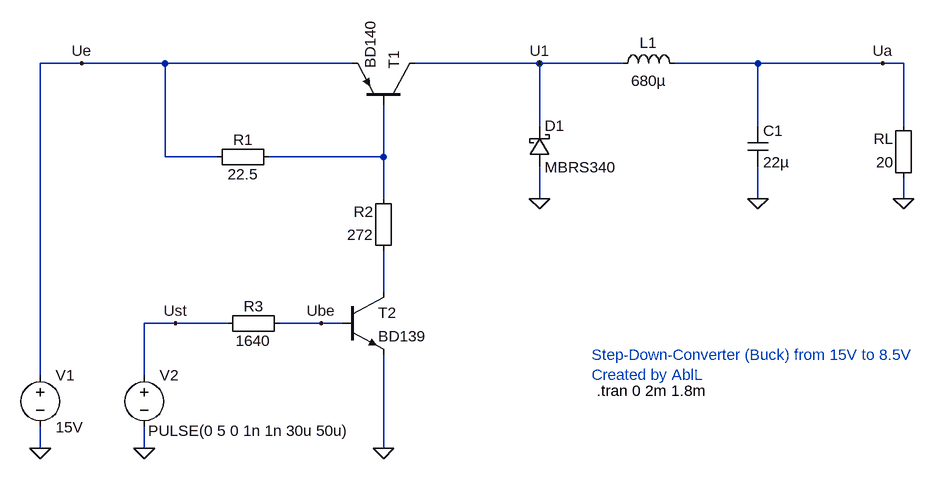
[diagram p0: schematic Step-Down-Converter.asc]
Step-Down-Converter.asc, the LTspice schematic file:
Version 4
SHEET 1 2692 704
WIRE 208 -160 144 -160
WIRE 336 -160 208 -160
WIRE 624 -160 336 -160
WIRE 912 -160 720 -160
WIRE 1040 -160 912 -160
WIRE 1248 -160 1120 -160
WIRE 1440 -160 1248 -160
WIRE 1472 -160 1440 -160
WIRE 912 -64 912 -160
WIRE 1248 -64 1248 -160
WIRE 1472 -64 1472 -160
WIRE 336 -16 336 -160
WIRE 416 -16 336 -16
WIRE 672 -16 672 -96
WIRE 672 -16 496 -16
WIRE 672 48 672 -16
WIRE 912 48 912 0
WIRE 1248 48 1248 0
WIRE 1472 48 1472 16
WIRE 672 192 672 128
WIRE 352 240 304 240
WIRE 432 240 352 240
WIRE 576 240 512 240
WIRE 608 240 576 240
WIRE 144 320 144 -160
WIRE 304 320 304 240
WIRE 144 432 144 400
WIRE 304 432 304 400
WIRE 672 432 672 288
FLAG 144 432 0
FLAG 304 432 0
FLAG 672 432 0
FLAG 912 48 0
FLAG 1248 48 0
FLAG 1472 48 0
FLAG 1440 -160 Ua
FLAG 208 -160 Ue
FLAG 352 240 Ust
FLAG 576 240 Ube
FLAG 912 -160 U1
SYMBOL voltage 144 304 R0
WINDOW 123 0 0 Left 0
WINDOW 39 0 0 Left 0
SYMATTR InstName V1
SYMATTR Value 15V
SYMBOL voltage 304 304 R0
WINDOW 3 6 101 Left 2
WINDOW 123 0 0 Left 0
WINDOW 39 0 0 Left 0
SYMATTR Value PULSE(0 5 0 1n 1n 30u 50u)
SYMATTR InstName V2
SYMBOL Misc\\EuropeanResistor 512 -32 R90
WINDOW 0 5 56 VBottom 2
WINDOW 3 27 56 VTop 2
SYMATTR InstName R1
SYMATTR Value 22.5
SYMBOL Misc\\EuropeanResistor 688 144 R180
WINDOW 0 31 76 Left 2
WINDOW 3 31 40 Left 2
SYMATTR InstName R2
SYMATTR Value 272
SYMBOL npn 608 192 R0
SYMATTR InstName T2
SYMATTR Value BD139
SYMBOL pnp 720 -96 M270
SYMATTR InstName T1
SYMATTR Value BD140
SYMBOL ind 1024 -144 R270
WINDOW 0 32 56 VTop 2
WINDOW 3 5 56 VBottom 2
SYMATTR InstName L1
SYMATTR Value 680µ
SYMBOL cap 1232 -64 R0
SYMATTR InstName C1
SYMATTR Value 22µ
SYMBOL Misc\\EuropeanResistor 1488 32 R180
WINDOW 0 31 76 Left 2
WINDOW 3 31 40 Left 2
SYMATTR InstName RL
SYMATTR Value 20
SYMBOL Misc\\EuropeanResistor 528 224 R90
WINDOW 0 5 56 VBottom 2
WINDOW 3 27 56 VTop 2
SYMATTR InstName R3
SYMATTR Value 1640
SYMBOL schottky 896 0 M180
WINDOW 0 24 64 Left 2
WINDOW 3 24 0 Left 2
SYMATTR InstName D1
SYMATTR Value MBRS340
TEXT 1000 344 Left 2 !.tran 0 2m 1.8m
TEXT 992 288 Left 2 ;Step-Down-Converter (Buck) from 15V to 8.5V\nCreated by AblL

The netlist it stands for:
* Step-Down-Converter.asc
V1 Ue 0 15V
V2 Ust 0 PULSE(0 5 0 1n 1n 30u 50u)
R1 N001 Ue 22.5
R2 N002 N001 272
Q§T2 N002 Ube 0 0 BD139
Q§T1 U1 N001 Ue 0 BD140
L1 U1 Ua 680µ
C1 Ua 0 22µ
RL 0 Ua 20
R3 Ube Ust 1640
D1 0 U1 MBRS340
.model D D
.lib standard.dio
.model NPN NPN
.model PNP PNP
.lib standard.bjt
.tran 0 2m 1.8m
* Step-Down-Converter (Buck) from 15V to 8.5V
* Created by AblL
.backanno
.end